# EAGLE schematic alt1.2 (EAGLE 6.6.0)
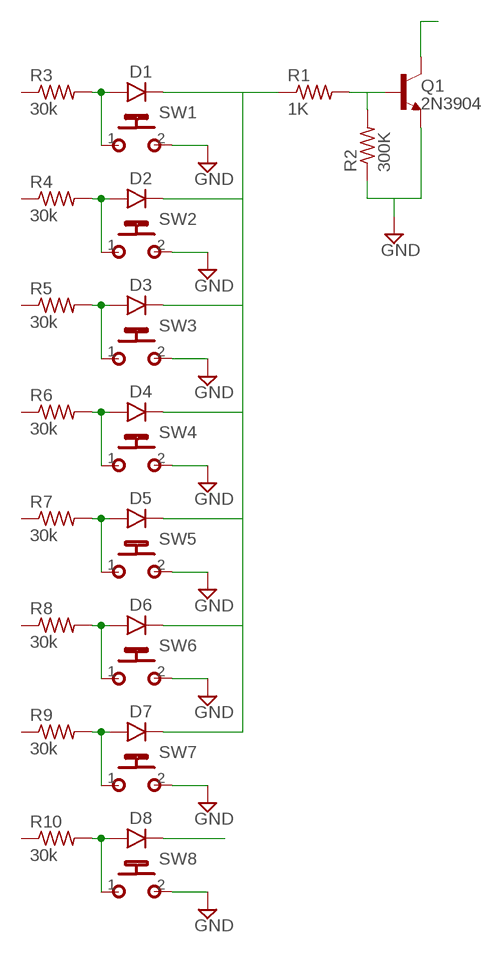
[diagram p0: schematic, sheet 1]

## Parts
D1  1N4148-3  [DO35-3]
D2  1N4148-3  [DO35-3]
D3  1N4148-3  [DO35-3]
D4  1N4148-3  [DO35-3]
D5  1N4148-3  [DO35-3]
D6  1N4148-3  [DO35-3]
D7  1N4148-3  [DO35-3]
D8  1N4148-3  [DO35-3]
Q1  2N3904  [TO92-]
R1  1K  6MM.3  [R0207/3]
R2  300K  6MM.3  [R0207/3]
R3  30k  6MM.3  [R0207/3]
R4  30k  6MM.3  [R0207/3]
R5  30k  6MM.3  [R0207/3]
R6  30k  6MM.3  [R0207/3]
R7  30k  6MM.3  [R0207/3]
R8  30k  6MM.3  [R0207/3]
R9  30k  6MM.3  [R0207/3]
R10  30k  6MM.3  [R0207/3]
SW1  MOMENTARYSPST1  [SPST]
SW2  MOMENTARYSPST1  [SPST]
SW3  MOMENTARYSPST1  [SPST]
SW4  MOMENTARYSPST1  [SPST]
SW5  MOMENTARYSPST1  [SPST]
SW6  MOMENTARYSPST1  [SPST]
SW7  MOMENTARYSPST1  [SPST]
SW8  MOMENTARYSPST1  [SPST]

## Nets
GND: Q1.3(E) R2.1 SW1.2(S) SW2.2(S) SW3.2(S) SW4.2(S) SW5.2(S) SW6.2(S) SW7.2(S) SW8.2(S)
N$1: Q1.2(B) R1.2 R2.2
N$2: D2.A R4.2 SW2.1(P)
N$3: Q1.1(C)
N$5: D1.A R3.2 SW1.1(P)
N$8: D3.A R5.2 SW3.1(P)
N$10: D4.A R6.2 SW4.1(P)
N$12: D5.A R7.2 SW5.1(P)
N$14: D6.A R8.2 SW6.1(P)
N$15: D1.C D2.C D3.C D4.C D5.C D6.C D7.C R1.1
N$16: D7.A R9.2 SW7.1(P)
N$18: D8.A R10.2 SW8.1(P)
N$19: D8.C
Unconnected: R3.1 R4.1 R5.1 R6.1 R7.1 R8.1 R9.1 R10.1

## Library data of the parts
D1-D8 = gm-diodes:1N4148: Fast Switching Diode DO-35 glass case a.k.a. 1N914
Q1 = gm-trans:2N3904: NPN Transistor
R1-R10 = gm-resistors:6MM: 6mm Resistors Leads spaced 1-6 holes apart for 0.1" perfboard. Suitable for 1/4 watt resistors.
SW1-SW8 = gm-switches:MOMENTARY